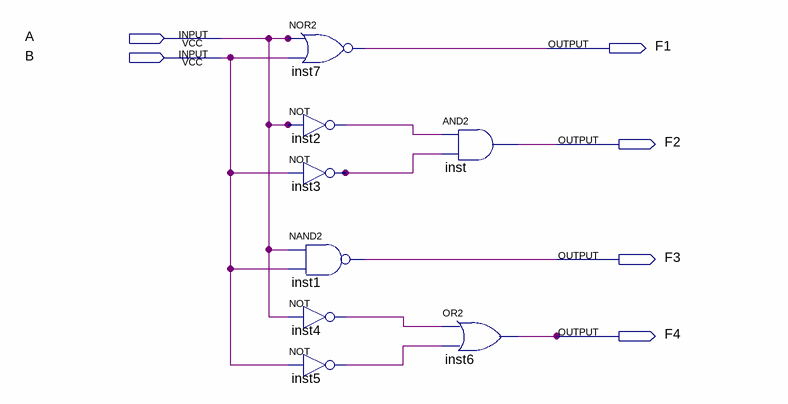
[diagram p0: schematic sheet]
// Quartus schematic 913042.bdf as structural Verilog: 8 symbols, 6 pins
module \913042  (
  input  A,
  input  B,
  output F1,
  output F2,
  output F3,
  output F4
);

  wire inst2_out, inst3_out, inst4_out, inst5_out;

  nor inst7 (F1, A, B);
  not inst2 (inst2_out, A);
  not inst3 (inst3_out, B);
  nand inst1 (F3, A, B);
  not inst4 (inst4_out, A);
  not inst5 (inst5_out, B);
  and inst (F2, inst2_out, inst3_out);
  or inst6 (F4, inst4_out, inst5_out);
endmodule
